# Altium project Onboarding.PrjPcb
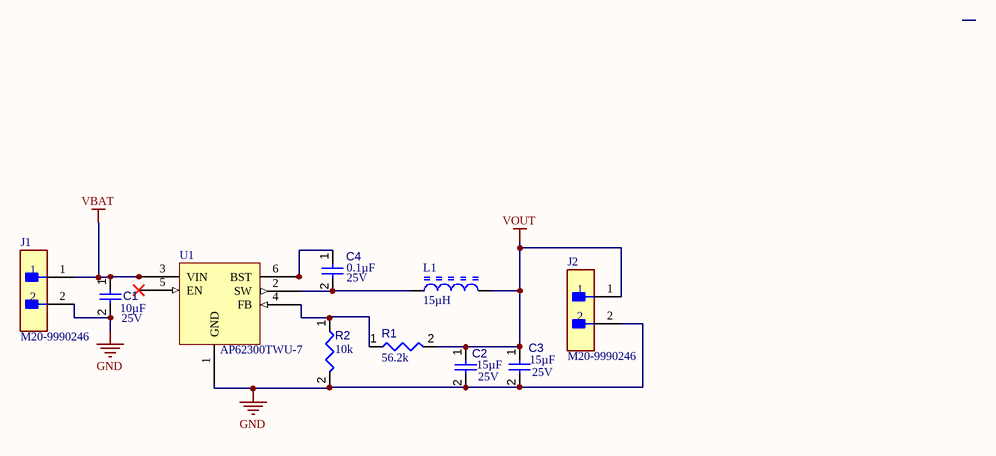
[diagram p0: Schematic.SchDoc]
1 sheet, 10 parts. Net scope: global (net labels, ports and power ports of the same name join across sheets).
Board file: OnboardingPCB.PcbDoc

## Sheet Schematic.SchDoc
size A4; SheetNumber: 1; SheetTotal: 1

### Parts
C1  value 10µF  Voltage Rating: 25V  [CAPC1608X90X35LL15T15]  (hidden comment: Capacitor 1uF +/- 10% 16V 0603)
C2  value 15µF  Voltage Rating: 25V  [CAPC1608X90X35ML15T15]  (hidden comment: Capacitor 1uF +/- 10% 16V 0603)
C3  value 15µF  Voltage Rating: 25V  [CAPC1608X90X35ML15T15]  (hidden comment: Capacitor 1uF +/- 10% 16V 0603)
C4  value 0.1µF  Voltage Rating: 25V  [CAPC1608X90X35ML15T15]  (hidden comment: Capacitor 1uF +/- 10% 16V 0603)
J1  M20-9990246  [FP-M20-9990246-MFG]
J2  M20-9990246  [FP-M20-9990246-MFG]
L1  Inductance: 15µH  [BOUR-CM322522_V]  (hidden comment: CM322522-100KL)
R1  value 56.2k  [RESC1608X55X25ML10T15]  (hidden comment: Resistor 10k +/-1% 0603 100 mW)
R2  value 10k  [RESC1608X55X25ML10T15]  (hidden comment: Resistor 10k +/-1% 0603 100 mW)
U1  AP62300TWU-7  [SOT95P280X100-6N]

### Nets
GND: C1.2 C2.2 C3.2 J1.2 J2.2 R2.2 U1.1(GND)
VBAT: C1.1 J1.1 U1.3(VIN)
VOUT: C2.1 C3.1 J2.1 L1.2 R1.2
NetC4_1: C4.1 U1.6(BST)
NetC4_2: C4.2 L1.1 U1.2(SW)
NetR1_1: R1.1 R2.1 U1.4(FB)

Not connected (* = marked no-connect by the designer): U1 5(EN)*

### Library data of the parts
C1-C4 = CMP-001-00004-6: Chip Capacitor, 1 uF, +/- 10%, 16 V, 0603 (1608 Metric); Capacitor Type: Ceramic; Mounting Technology: SM; RoHS Compliant: True; Min Operating Temperature: -55°C; Case/Package: 0603; Pins: 2; Max Operating Temperature: 125°C; Tolerance: 10%
J1 J2 = CMP-15831-000009-1: CONN HEADER VERT 2POS 2.54MM; Manufacturer: Harwin; Conn Gender: Male; Description: Connector Header Through Hole 2 position 0.100" (2.54mm); Conn Orientation: Vertical; Number Of Contacts: 2; Current Rating: 3A; ComponentLink2URL: https://cdn.harwin.com/pdfs/M20-999.pdf; ComponentLink2Description: Datasheet; Package: M20-9990246; Temperature: -40°C to +105°C; Octopart: https://octopart.com/m20-9990246-harwin-2590635; Mouser Description: 2.54mm (0.1") Pitch SIL Vertical PC Tail Pin Header, 6.1mm mating pin height, tin, 2 contacts; Temperature Range High: +105°C; Device Class L1: Connectors; RoHS: TRUE; Automotive: No; Height: 8.99mm; Number Of Rows: 1; Contact Material: Tin,Nickel; Category: Conn; Pitch: 2.54mm; Lead Free: Yes; Digikey Description: CONN HEADER VERT 2POS 2.54MM; Manufacturer Part Number: M20-9990246; Temperature Range Low: -40°C; Device Class L3: unset; Device Class L2: Headers and Wire Housings
L1 = CMP-006-00005-3: Chip Inductor, 10 uH, +/- 10%, -40 to 125 degC, 1210 (3225 Metric), RoHS, Tape and Reel; Manufacturer: Bourns; Q Factor: 30; Self Resonant Frequency: 30MHz; Core Material: Ferrite; Shielding: Unshielded; Resistance: 2.1Ohm; Mounting Technology: SM; Min Operating Temperature: -20°C; Datasheet URL: http://www.murata.com/~/media/webrenewal/support/library/catalog/products/emc/emifil/c30e.ashx?la=en-gb; Case/Package: 1210; Pins: 2; Package Description: 2-Pin Surface Mount Device, Body 3.2 x 2.5 mm; RoHS Compliant: True; Max Operating Temperature: 100°C; Inductance Tolerance: 10%; Package Reference: 1210; Packaging: TapeandReel; Package Quantity: 1; Datasheet Version: Aug-14; Tolerance: 10%
R1 = CMP-009-00017-5: Chip Resistor, 56.2 KOhm, +/- 1%, 01 W, -55 to 155 degC, 0603 (1608 Metric); Voltage Rating: 50V; Power: 100mW; RoHS Compliant: True; Min Operating Temperature: -55°C; Pins: 2; Case/Package: 0603; Mounting Technology: SM; Max Operating Temperature: 155°C; Tolerance: 1%
R2 = CMP-009-00017-5: Chip Resistor, 10 KOhm, +/- 1%, 01 W, -55 to 155 degC, 0603 (1608 Metric); Voltage Rating: 50V; Power: 100mW; RoHS Compliant: True; Min Operating Temperature: -55°C; Pins: 2; Case/Package: 0603; Mounting Technology: SM; Max Operating Temperature: 155°C; Tolerance: 1%
U1 = CMP-031-00006-1: DC-DC Switching Synchronous Buck Regulator, Adjustable, 4.2V-18Vin, 0.8V-7V/3A out, TSOT-26-6; Max Supply Voltage: 18V; Min Operating Temperature: -40°C; Case/Package: VSSOP; Max Operating Temperature: 85°C